# EAGLE schematic BLE RN4020 - Si7021 Test (EAGLE 9.2.2)
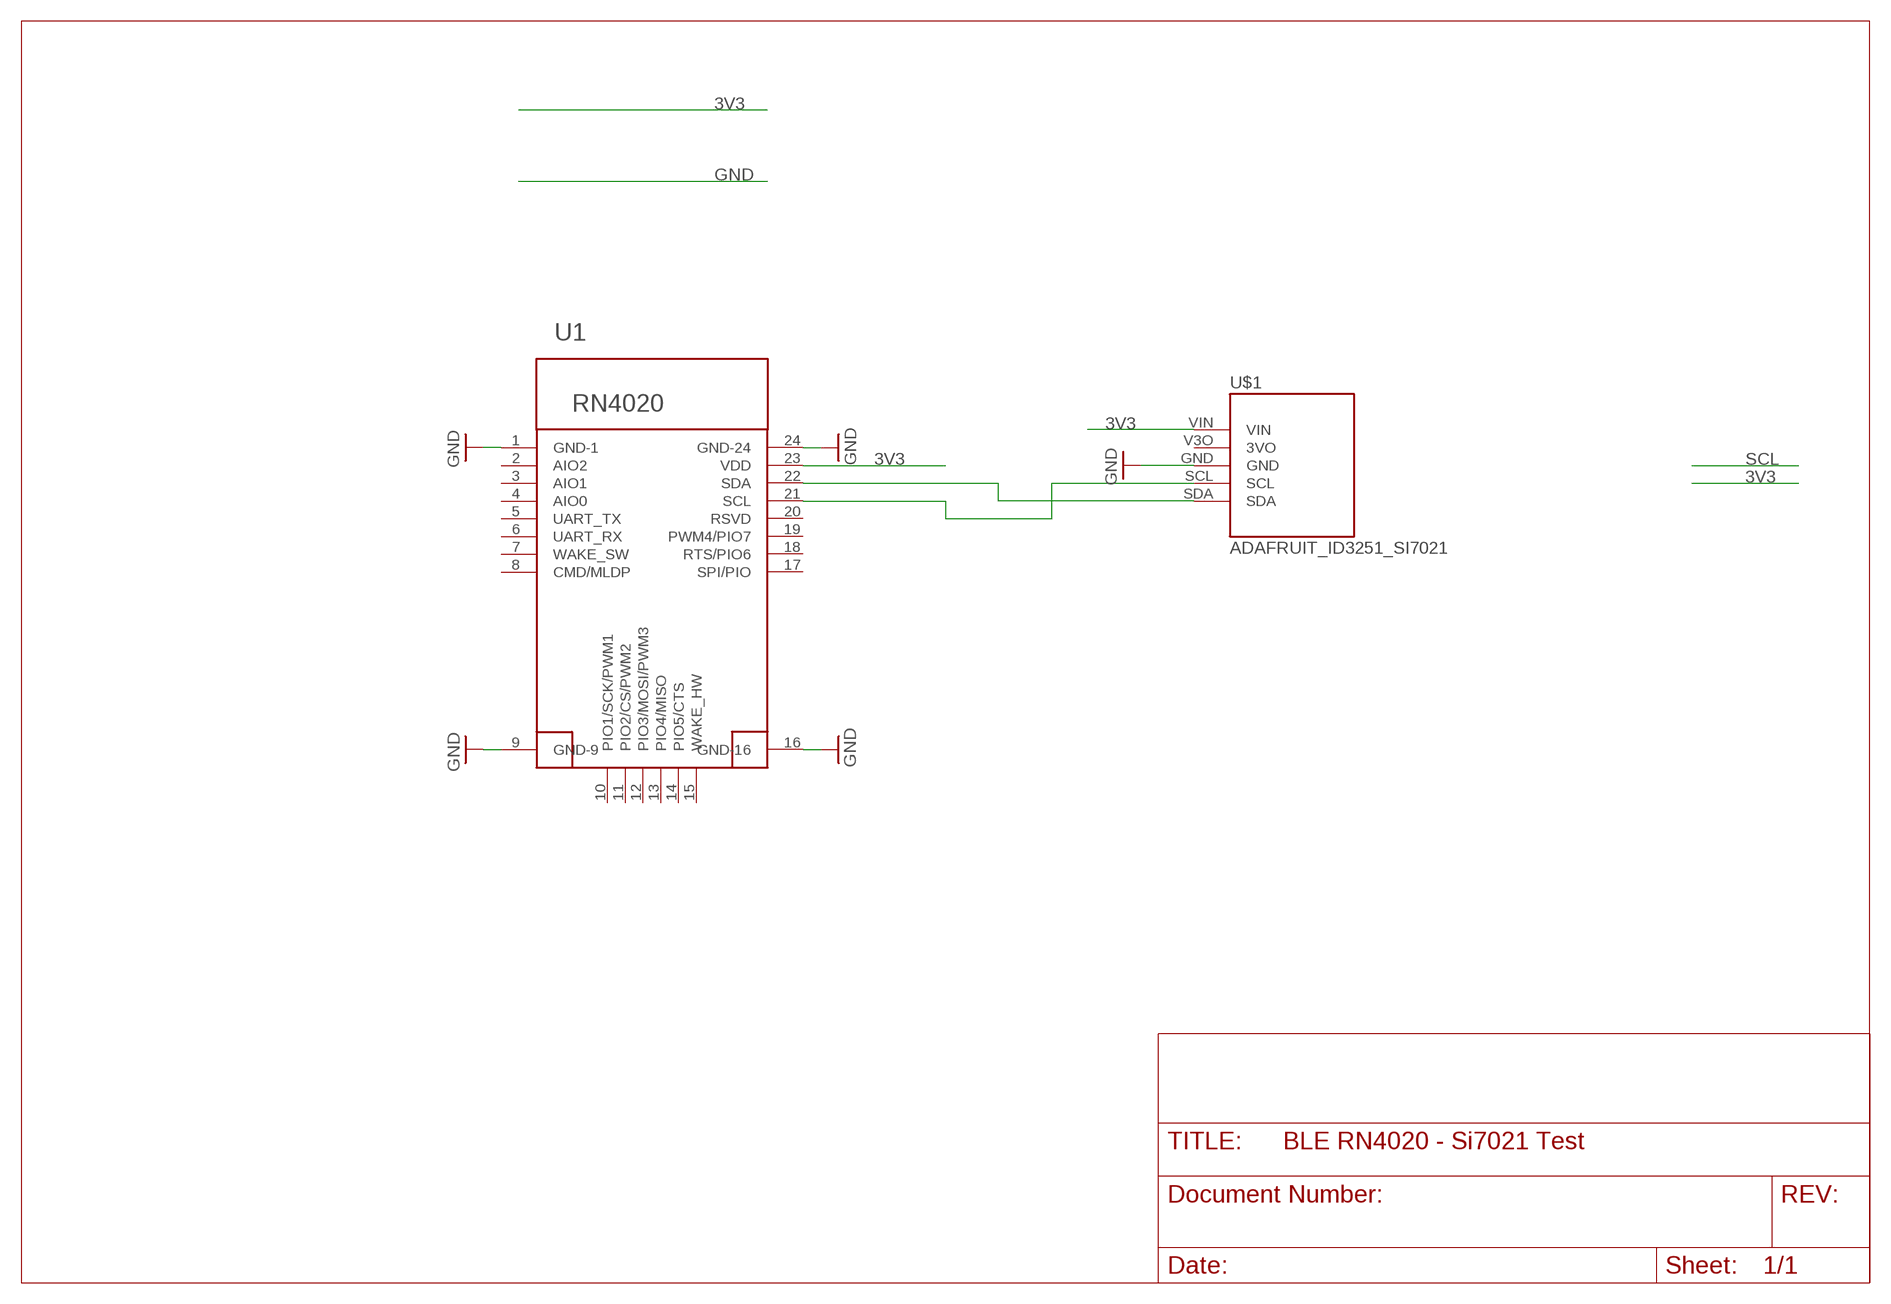
[diagram p0: schematic, sheet 1]

## Parts
U1  RN4020  [RN4020]
U$1  ADAFRUIT_ID3251_SI7021  [ADAFRUIT_ID3251_SI7021]

## Nets
3V3: U1.23(VDD) U$1.VIN
GND: U1.1(GND-1) U1.9(GND-9) U1.16(GND-16) U1.24(GND-24) U$1.GND
N$1: U1.22(SDA) U$1.SDA
N$2: U1.21(SCL) U$1.SCL
Unconnected: U1.2(AIO2) U1.3(AIO1) U1.4(AIO0) U1.5(UART_TX) U1.6(UART_RX) U1.7(WAKE_SW) U1.8(CMD/MLDP) U1.10(PIO1/SCK/PWM1) U1.11(PIO2/CS/PWM2) U1.12(PIO3/MOSI/PWM3) U1.13(PIO4/MISO) U1.14(PIO5/CTS) U1.15(WAKE_HW) U1.17(SPI/PIO) U1.18(RTS/PIO6) U1.19(PWM4/PIO7) U1.20(RSVD)

## Power pins joined to a net without a drawn wire
3VO: U$1.V3O(3VO)

## Library data of the parts
U1 = esao:RN4020: Microchhip RN4020 Bluetooth® 4.1 Low Energy Module source: Datasheet <https://www.mouser.fi/ProductDetail/Microchip-Technology/RN4020-V-RMBEC133?qs=%2fha2pyFadui0SsXSplcdmSs5jU1zsLntGcLpD2Yv54SfP5zXGtgys8DqczVzwD56>; DESCRIPTION: RN4020 Bluetooth 4.1 Module; MPN: RN4020-V/RMBEC133; OC_FARNELL: 2835936; PACKAGE: RN serie; SUPPLIER: Microchip Technology
U$1 = Adafruit:ADAFRUIT_ID3251_SI7021: Adafruit Si7021 Temperature & Humidity Sensor Breakout Board